# EAGLE schematic Nano XBee (EAGLE 7.0.0)
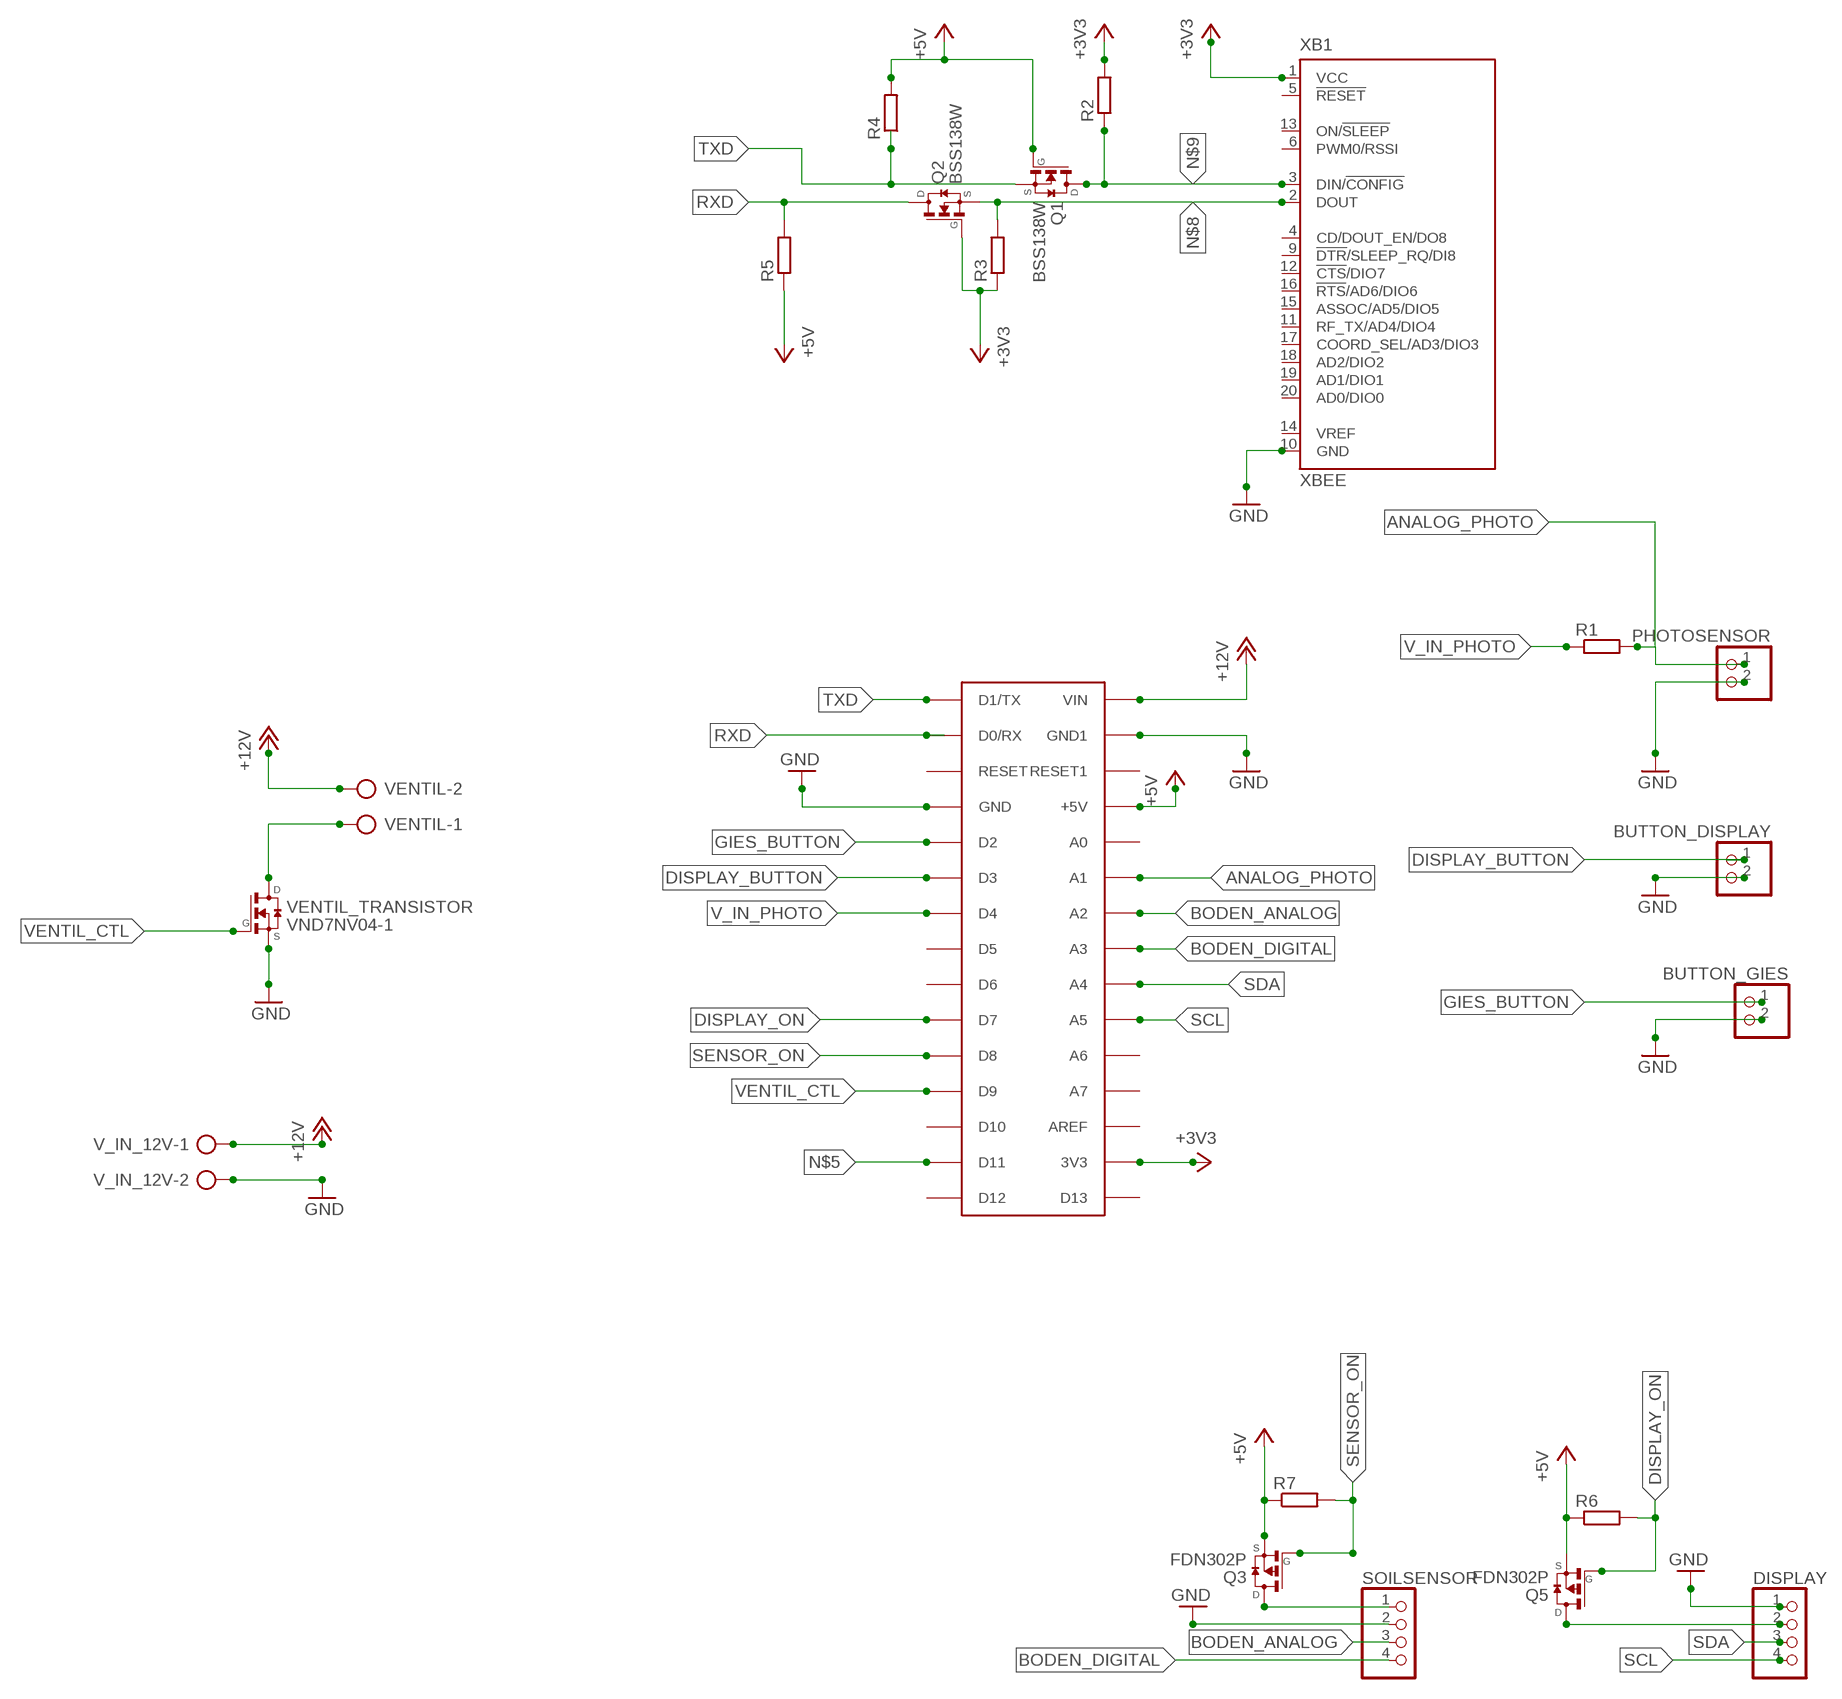
[diagram p0: schematic, sheet 1]

## Parts
BUTTON_DISPLAY  PINHD-1X2  [1X02]
BUTTON_GIES  PINHD-1X2  [1X02]
DISPLAY  PINHD-1X4  [1X04]
PHOTOSENSOR  PINHD-1X2  [1X02]
Q1  BSS138W  [SOT323-R]
Q2  BSS138W  [SOT323-R]
Q3  FDN302P  [SSOT-3]
Q5  FDN302P  [SSOT-3]
R1  R-EU_0207/7  [0207/7]
R2  R-EU_M0805  [M0805]
R3  R-EU_M0805  [M0805]
R4  R-EU_M0805  [M0805]
R5  R-EU_M0805  [M0805]
R6  R-EU_M0805  [M0805]
R7  R-EU_M0805  [M0805]
SOILSENSOR  PINHD-1X4  [1X04]
U$1  ARDUINONANO  [PDIP-32]
V_IN_12V  AK500/2  [AK500/2]
VENTIL  AK500/2  [AK500/2]
VENTIL_TRANSISTOR  VND7NV04-1  [IPAK]
XB1  XBEE  [XBEE]

## Nets
+3V3: Q2.1(G) R2.2 R3.1 U$1.3V3 XB1.1(VCC)
+5V: Q1.1(G) Q3.2(S) Q5.2(S) R4.2 R5.1 R6.1 R7.1 U$1.+5V
+12V: U$1.VIN V_IN_12V.1 VENTIL.2
ANALOG_PHOTO: PHOTOSENSOR.1 R1.2 U$1.A1
BODEN_ANALOG: SOILSENSOR.3 U$1.A2
BODEN_DIGITAL: SOILSENSOR.4 U$1.A3
DISPLAY_BUTTON: BUTTON_DISPLAY.1 U$1.D3
DISPLAY_ON: Q5.1(G) R6.2 U$1.D7
GIES_BUTTON: BUTTON_GIES.1 U$1.D2
GND: BUTTON_DISPLAY.2 BUTTON_GIES.2 DISPLAY.1 PHOTOSENSOR.2 SOILSENSOR.2 U$1.GND U$1.GND1 V_IN_12V.2 VENTIL_TRANSISTOR.3(S) XB1.10(GND)
N$1: DISPLAY.2 Q5.3(D)
N$2: VENTIL.1 VENTIL_TRANSISTOR.2(D)
N$3: Q3.3(D) SOILSENSOR.1
N$5: U$1.D11
N$8: Q2.2(S) R3.2 XB1.2(DOUT)
N$9: Q1.3(D) R2.1 XB1.3(DIN/!CONFIG)
RXD: Q2.3(D) R5.2 U$1.D0/RX
SCL: DISPLAY.4 U$1.A5
SDA: DISPLAY.3 U$1.A4
SENSOR_ON: Q3.1(G) R7.2 U$1.D8
TXD: Q1.2(S) R4.1 U$1.D1/TX
V_IN_PHOTO: R1.1 U$1.D4
VENTIL_CTL: U$1.D9 VENTIL_TRANSISTOR.1(G)
Unconnected: U$1.A0 U$1.A6 U$1.A7 U$1.AREF U$1.D5 U$1.D6 U$1.D10 U$1.D12 U$1.D13 U$1.RESET U$1.RESET1 XB1.4(CD/DOUT_EN/DO8) XB1.5(!RESET) XB1.6(PWM0/RSSI) XB1.9(!DTR!/SLEEP_RQ/DI8) XB1.11(RF_TX/AD4/DIO4) XB1.12(!CTS!/DIO7) XB1.13(ON/!SLEEP) XB1.14(VREF) XB1.15(ASSOC/AD5/DIO5) XB1.16(!RTS!/AD6/DIO6) XB1.17(COORD_SEL/AD3/DIO3) XB1.18(AD2/DIO2) XB1.19(AD1/DIO1) XB1.20(AD0/DIO0)

## Library data of the parts
BUTTON_DISPLAY BUTTON_GIES PHOTOSENSOR = pinhead:PINHD-1X2: PIN HEADER
DISPLAY SOILSENSOR = pinhead:PINHD-1X4: PIN HEADER
Q1 Q2 = transistor-fet:BSS138W: N-Channel MOSFET
Q3 Q5 = transistor-fet:FDN302P: P-Channel MOSFET 2.5V Specified PowerTrench
R1-R7 = rcl:R-EU_: RESISTOR, European symbol
U$1 = jet-lib:ARDUINONANO
V_IN_12V VENTIL = con-ptr500:AK500/2: CONNECTOR; OC_FARNELL: unknown; OC_NEWARK: unknown
VENTIL_TRANSISTOR = transistor-fet:VND7NV04-1: POWER MOSFET N-CH OMNIFET-II 40V 6A IPAK
XB1 = maxstream:XBEE: XBee (TM) /XBee-PRO(TM) OEM RF Modules Source: MaxStream, Inc. xbee_productmanual.pdf; MPN: XBP24-Z7UIT-004; OC_FARNELL: 1751799; OC_NEWARK: 34R5507